# EAGLE design CC2538-CP2102-Zigbee-V002-not-produced (EAGLE 9.5.1)
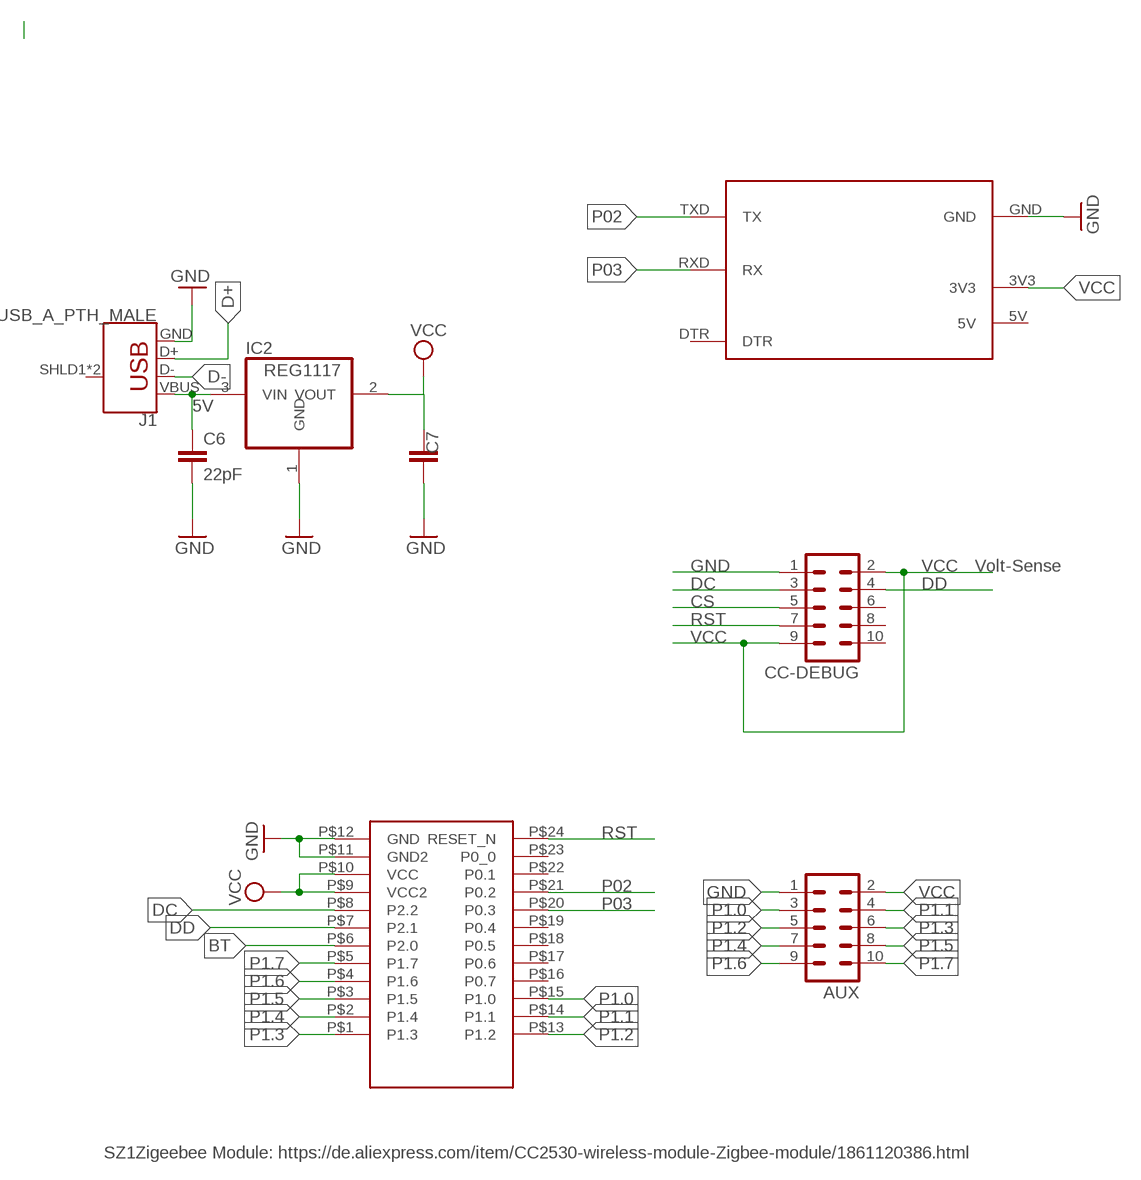
[diagram p0: schematic, sheet 1]

## Parts
AUX  MA05-2  [MA05-2]
C6  22pF  C-EUC0805  [C0805]
C7  C-EUC1812  [C1812]
CC-DEBUG  MA05-2  [MA05-2]
IC2  REG1117  [SOT223]
J1  USB_A_PTH_MALE  [USB-A-H]
U$1  CC2530  [SZ1ZIGBEE-SMD]
U$2  CP2101  [CP2101-BEAKOUT]

## Nets
5V [PWR]: C6.1 IC2.3(VIN) J1.VBUS
BT: U$1.P$6(P2.0)
CS: CC-DEBUG.5
D+: J1.D+
D-: J1.D-
DC: CC-DEBUG.3 U$1.P$8(P2.2)
DD: CC-DEBUG.4 U$1.P$7(P2.1)
GND [PWR]: AUX.1 C6.2 C7.1 CC-DEBUG.1 IC2.1(GND) J1.GND U$1.P$11(GND2) U$1.P$12(GND) U$2.GND
P1.0: AUX.3 U$1.P$15(P1.0)
P1.1: AUX.4 U$1.P$14(P1.1)
P1.2: AUX.5 U$1.P$13(P1.2)
P1.3: AUX.6 U$1.P$1(P1.3)
P1.4: AUX.7 U$1.P$2(P1.4)
P1.5: AUX.8 U$1.P$3(P1.5)
P1.6: AUX.9 U$1.P$4(P1.6)
P1.7: AUX.10 U$1.P$5(P1.7)
P02: U$1.P$21(P0.2) U$2.TXD(TX)
P03: U$1.P$20(P0.3) U$2.RXD(RX)
RST: CC-DEBUG.7 U$1.P$24(RESET_N)
VCC [PWR]: AUX.2 C7.2 CC-DEBUG.2 CC-DEBUG.9 IC2.2(VOUT) U$1.P$9(VCC2) U$1.P$10(VCC) U$2.3V3
Unconnected: CC-DEBUG.6 CC-DEBUG.8 CC-DEBUG.10 J1.SHLD1(SHIELD) J1.SHLD2(SHIELD) U$1.P$16(P0.7) U$1.P$17(P0.6) U$1.P$18(P0.5) U$1.P$19(P0.4) U$1.P$22(P0.1) U$1.P$23(P0_0) U$2.DTR

## Notes on the sheet
- Volt-Sense
- SZ1Zigeebee Module: https://de.aliexpress.com/item/CC2530-wireless-module-Zigbee-module/1861120386.html

## Power pins joined to a net without a drawn wire
5V: U$2.5V

## Library data of the parts
AUX CC-DEBUG = con-lstb:MA05-2: PIN HEADER; OC_FARNELL: unknown; OC_NEWARK: unknown
C6 C7 = rcl:C-EU: CAPACITOR, European symbol; SPICEPREFIX: C
IC2 = burr-brown:REG1117: 800mA and 1A Low Dropout (LDO) Positive Regulator 1.8V, 2.5V, 2.85V, 3.3V, 5V, and Adj; MPN: REG1117; OC_FARNELL: 1097566; OC_NEWARK: 14P6981
J1 = SparkFun-Connectors:USB_A: USB-A Connector Male and female variants, as well as PTH and SMT variants SparkFun Products: SparkFun XBee Explorer Dongle <https://www.sparkfun.com/products/11697> PTH Male SparkFun MicroView-USB Programmer <https://www.sparkfun.com/products/12924> SMT Male SparkFun USB Type A Female Breakout <https://www.sparkfun.com/products/12700> SMT Female; PROD_ID: CONN-08367; SF_ID: PRT-00437
U$1 = zigbee:CC2530: CC2530 Wireless Zigbee Module 3.0-3.6V 2.405-2.485GHz SMD Pads !
U$2 = Martin-USB-V001:CP2101

## Net classes
0 default: width 0.305 mm
1 PWR: width 0.61 mm

## Board
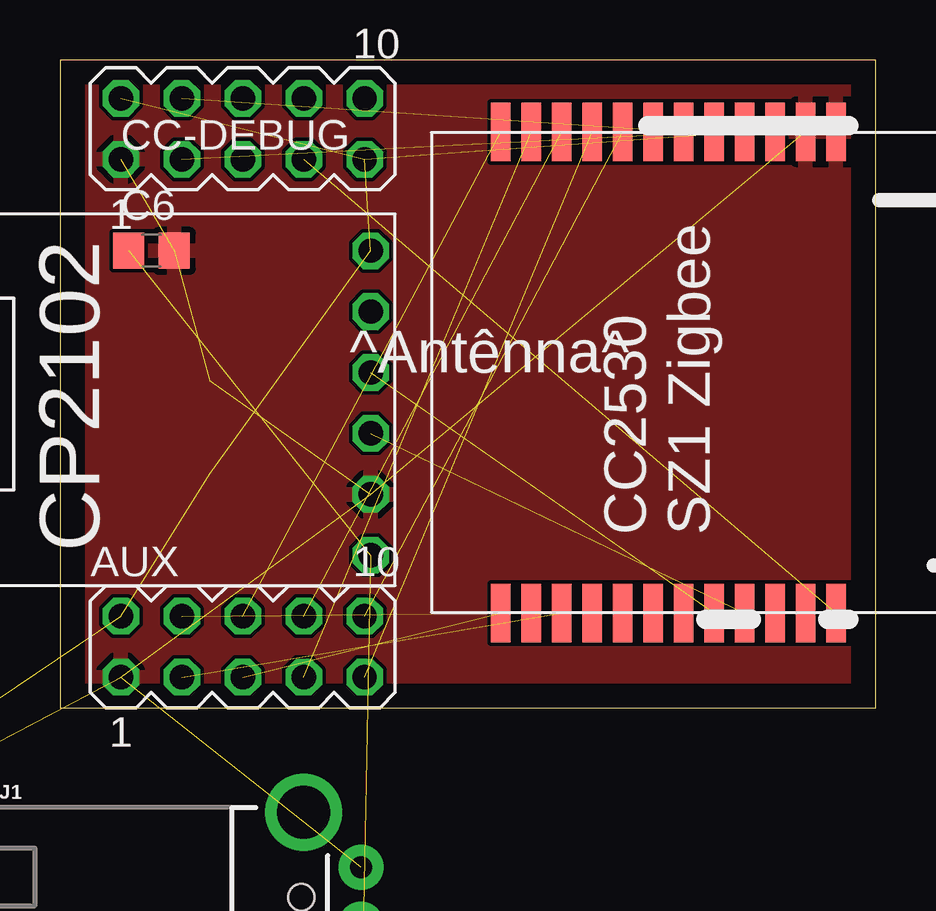
[diagram p1: board, top side]
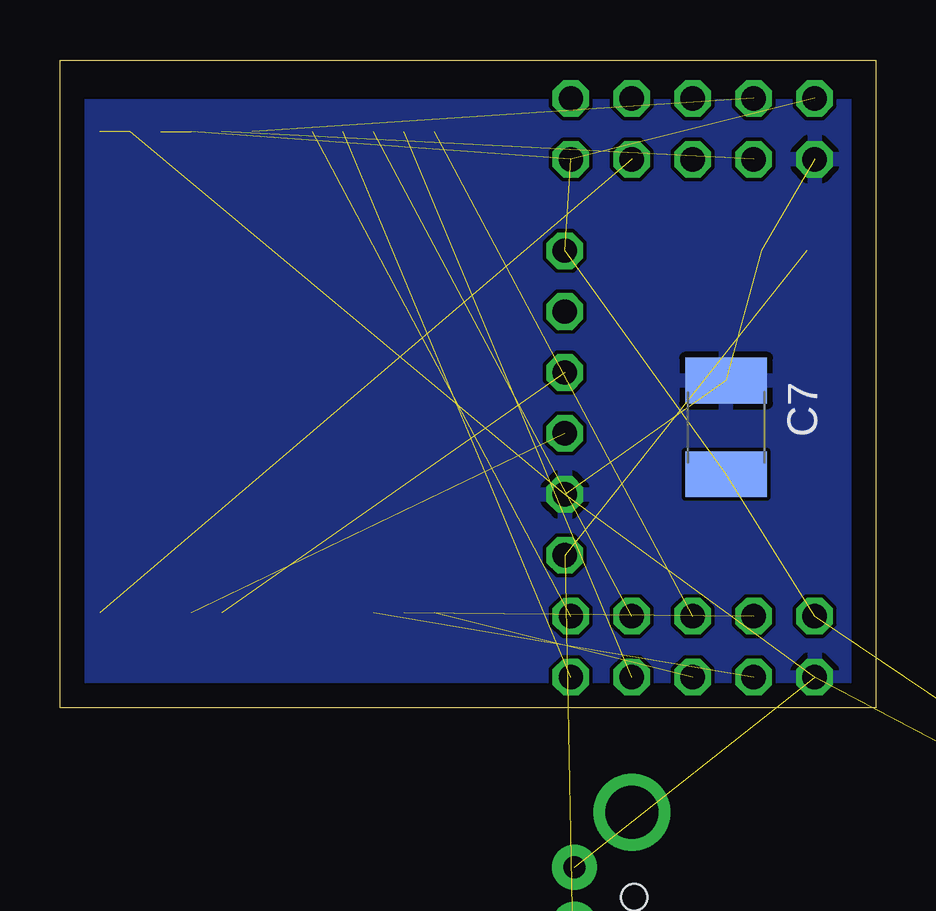
[diagram p2: board, bottom side, seen from below]

Size 34 x 27 mm. Coordinates in mm from the lower left corner, seen from the top.
Outline: 0,0 34,0 34,27 0,27 0,0
Copper layers (1*16): Top 0.035mm / dielectric 1.5mm / Bottom 0.035mm
Design rules "default": minimum track width 6mil, minimum drill 0.35mm, track to track 6mil, track to pad 6mil, pad to pad 6mil, via to via 6mil, smd to smd 6mil, copper to edge 40mil, drill to drill 6mil, minimum pad ring 10mil, minimum via ring 8mil, stop-mask expansion 4mil, vias tented up to drill 0mil, thermal gap 10mil

### Footprints (pad centres in the part's own frame; a part is rotated, then mirrored left to right if it is on the bottom)
MA05-2 = drill 1.016 octagon: 1 -5.08,-1.27; 2 -5.08,1.27; 3 -2.54,-1.27; 4 -2.54,1.27; 5 0,-1.27; 6 0,1.27; 7 2.54,-1.27; 8 2.54,1.27; 9 5.08,-1.27; 10 5.08,1.27
C0805 = smd 1.3 x 1.5: 1 -0.95,0; 2 0.95,0
C1812 = smd 1.9 x 3.4: 1 -1.95,0; 2 1.95,0
SOT223 = smd 1.499 x 2.007: 1 -2.261,-3.15; 2 0.025,-3.15; 3 2.311,-3.15 | smd 3.81 x 2.007: 4 0,3.15
USB-A-H = drill 0.914 pad 1.88: D+ 2.4,1.127; D- 2.4,-1.127; GND 2.4,3.5; VBUS 2.4,-3.5 | drill 2.2: SHLD1 0,-5.8; SHLD2 0,5.8 | hole 1.1: -0.1,2.25; -0.1,-2.25
SZ1ZIGBEE-SMD = smd 2.438 x 0.813: P$1 -10.036,-12.101; P$2 -10.036,-10.831; P$3 -10.036,-9.561; P$4 -10.036,-8.291; P$5 -10.036,-7.021; P$6 -10.036,-5.751; P$7 -10.036,-4.481; P$8 -10.036,-3.211; P$9 -10.036,-1.941; P$10 -10.036,-0.671; P$11 -10.036,0.599; P$12 -10.036,1.869; P$13 10.03,-12.101; P$14 10.03,-10.831; P$15 10.03,-9.561; P$16 10.03,-8.291; P$17 10.03,-7.021; P$18 10.03,-5.751; P$19 10.03,-4.481; P$20 10.03,-3.211; P$21 10.03,-1.941; P$22 10.03,-0.671; P$23 10.03,0.599; P$24 10.03,1.869
CP2101-BEAKOUT = drill 1.016 octagon: 3V3 13.97,1.016; 5V 1.27,1.016; DTR 11.43,1.016; GND 3.81,1.016; RXD 8.89,1.016; TXD 6.35,1.016

### Placement (x,y rotation side)
AUX  7.62,2.54 0 top
C6  3.81,19.05 0 top
C7  6.23,11.69 270 bottom
CC-DEBUG  7.62,24.13 0 top
IC2  -22.86,-10.16 0 top  (outside the outline)
J1  10.16,-10.16 0 top  (outside the outline)
U$1  30.48,13.97 270 top
U$2  13.97,5.08 90 top

### Tracks (layer width: path | path; a pad name or v marks a point on that pad's centre or on a via)
5V  (3 unrouted)
DC  (1 unrouted)
DD  (1 unrouted)
GND  (8 unrouted)
  pour Top: 0.64,26.04 33.02,26.04 33.02,1.27 0.64,1.27
  pour Bottom: 0.64,1.27 0.64,25.08 33.02,25.08 33.02,1.27
P1.0  (1 unrouted)
P1.1  (1 unrouted)
P1.2  (1 unrouted)
P1.3  (1 unrouted)
P1.4  (1 unrouted)
P1.5  (1 unrouted)
P1.6  (1 unrouted)
P1.7  (1 unrouted)
P02  (1 unrouted)
P03  (1 unrouted)
RST  (1 unrouted)
VCC  (7 unrouted)

### Text on the board
tNames: ^Antênna^